# Altium schematic sheet Main.SchDoc
size 430 x 369 mm; SheetNumber: 1; SheetTotal: 14
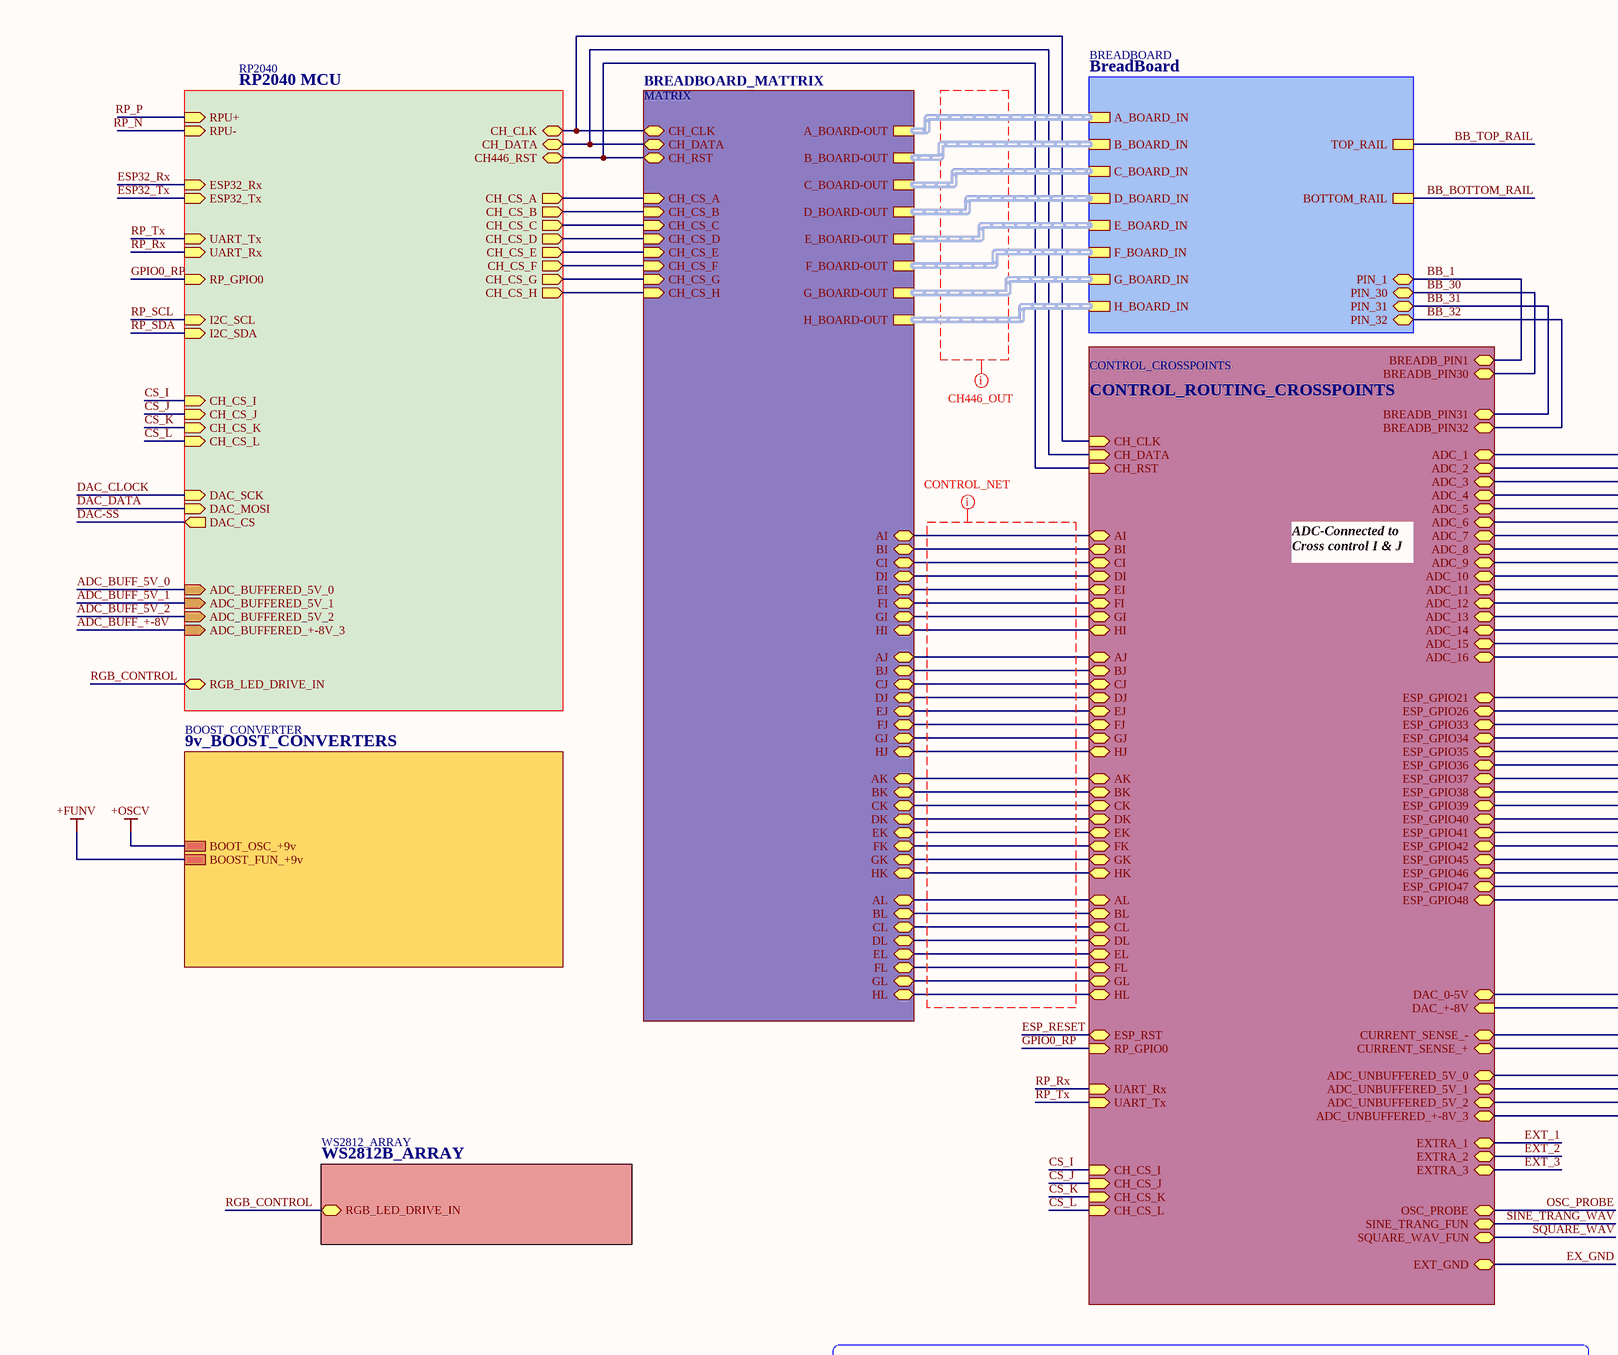
[diagram p0: Main.SchDoc, top left]
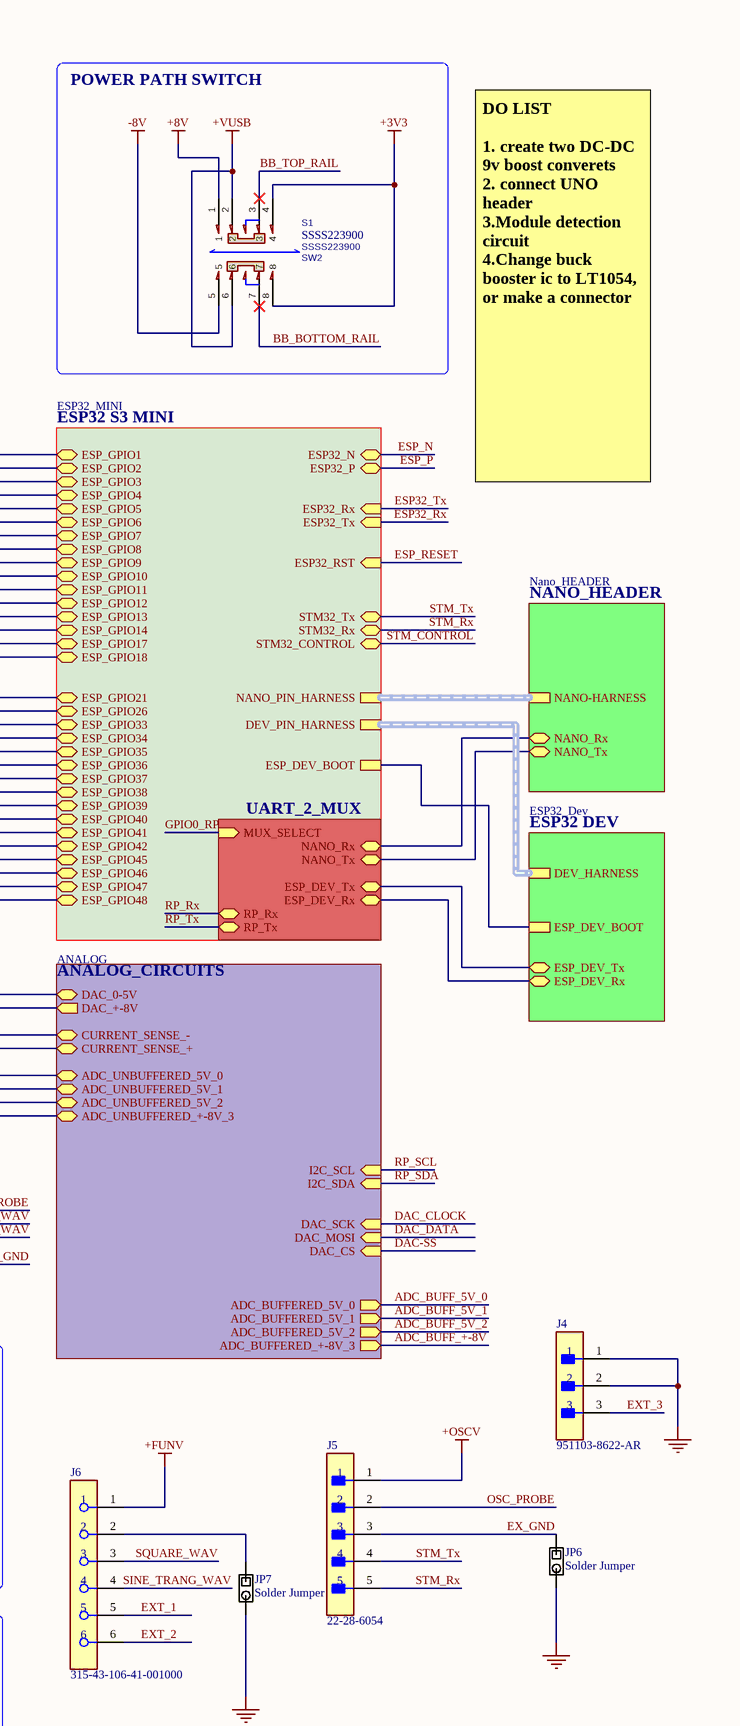
[diagram p1: Main.SchDoc, top right]
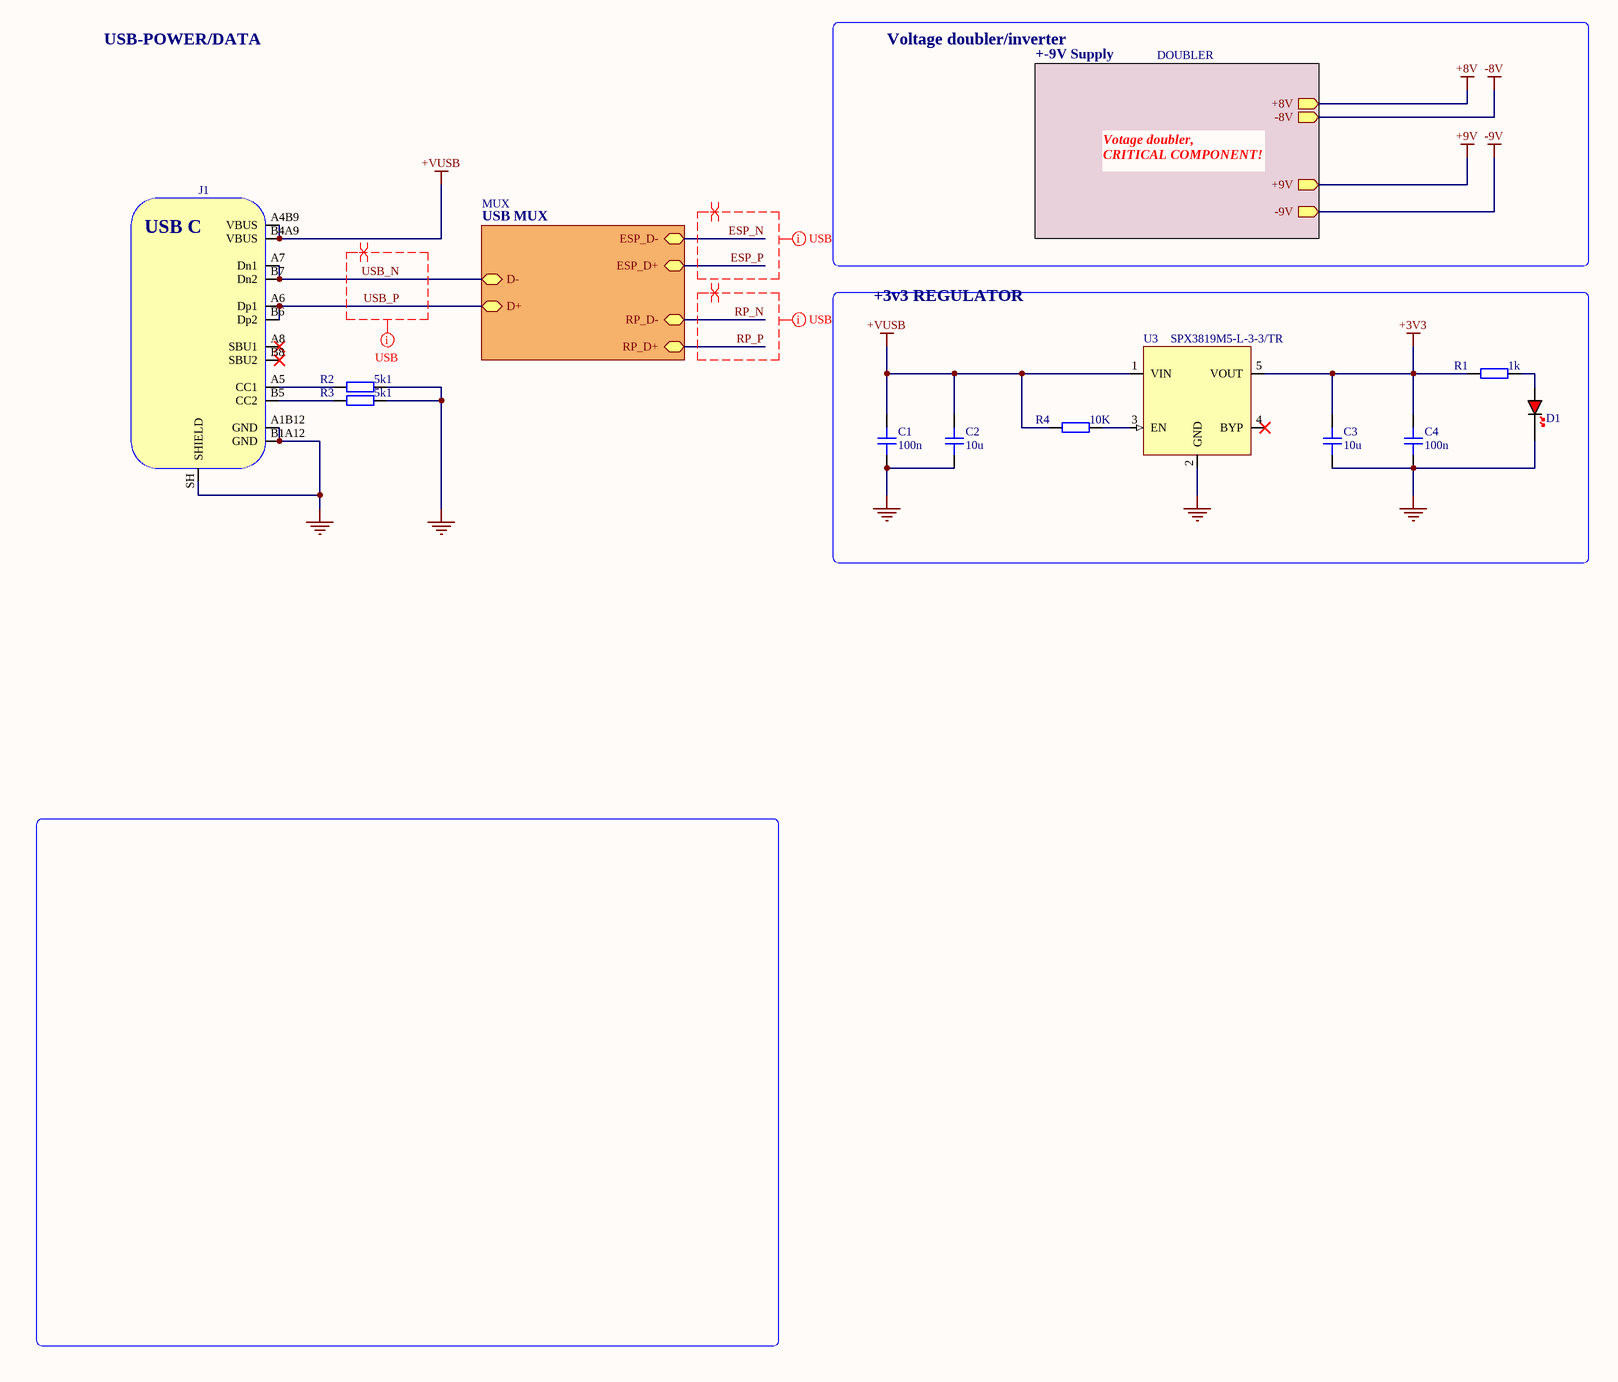
[diagram p2: Main.SchDoc, bottom left]
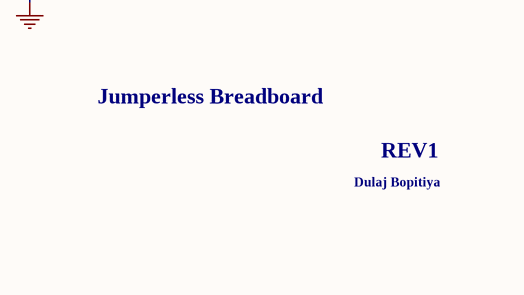
[diagram p3: Main.SchDoc, bottom right]

## Parts
C1  100n  [CAP_0805]
C2  10u  [CAP_0805]
C3  10u  [CAP_0805]
C4  100n  [CAP_0805]
D1  RED  [LED_0603_RED]  (value not drawn)
J1  B4105-GF-A-060  [USB4105-GF-A-060]  (value not drawn)
J4  951103-8622-AR  [FP-951103-8622-AR-MFG]
J5  22-28-6054  [FP-22-28-6054-MFG]
J6  315-43-106-41-001000  [FP-315-43-106-41-001000-MFG]
JP6  Solder Jumper  [SolderJumper_Single]
JP7  Solder Jumper  [SolderJumper_Single]
R1  1k  [RES_0603]
R2  5k1  [RES_0603]
R3  5k1  [RES_0603]
R4  10K  [RES_0603]
S1  SSSS223900  Reference: SW2  [SW-TH_SSSS223900]
U3  SPX3819M5-L-3-3/TR  [SOT-23-5]

## Blocks framed on the sheet
POWER PATH SWITCH: S1
+3v3 REGULATOR: C1-C4 D1 R1 R4 U3

## Sub-sheets
ANALOG = ANALOG_CIRCUITS: ADC_UNBUFFERED_5V_0 (bidir), ADC_BUFFERED_5V_0 (out), ADC_UNBUFFERED_5V_1 (bidir), ADC_BUFFERED_5V_1 (out), ADC_UNBUFFERED_5V_2 (bidir), ADC_BUFFERED_5V_2 (out), ADC_UNBUFFERED_+-8V_3 (bidir), ADC_BUFFERED_+-8V_3 (out), DAC_+-8V (out), DAC_MOSI (in), DAC_SCK (in), DAC_CS (in), I2C_SCL (in), I2C_SDA (in), CURRENT_SENSE_+ (bidir), CURRENT_SENSE_- (bidir), DAC_0-5V (bidir)
BOOST_CONVERTER = 9v_BOOST_CONVERTERS: BOOT_OSC_+9v, BOOST_FUN_+9v
BREADBOARD = BreadBoard: A_BOARD_IN (harness A_BOARD_H), B_BOARD_IN (harness B_BOARD_H), C_BOARD_IN (harness C_BOARD_H), D_BOARD_IN (harness D_BOARD_H), E_BOARD_IN (harness E_BOARD_H), F_BOARD_IN (harness F_BOARD_H), G_BOARD_IN (harness G_BOARD_H), H_BOARD_IN (harness H_BOARD_H), PIN_1 (bidir), PIN_31 (bidir), PIN_32 (bidir), PIN_30 (bidir), TOP_RAIL, BOTTOM_RAIL
CONTROL_CROSSPOINTS = CONTROL_ROUTING_CROSSPOINTS: CH_CLK (in), CH_DATA (in), CH_RST (in), AI (bidir), BI (bidir), CI (bidir), DI (bidir), EI (bidir), FI (bidir), GI (bidir), HI (bidir), AJ (bidir), BJ (bidir), CJ (bidir), DJ (bidir), EJ (bidir), FJ (bidir), GJ (bidir), HJ (bidir), AK (bidir), BK (bidir), CK (bidir), DK (bidir), EK (bidir), FK (bidir), GK (bidir), HK (bidir), AL (bidir), BL (bidir), CL (bidir), DL (bidir), EL (bidir), FL (bidir), GL (bidir), HL (bidir), CH_CS_I (in), CH_CS_J (in), CH_CS_K (in), CH_CS_L (in), ADC_1 (bidir), ADC_2 (bidir), ADC_3 (bidir), ADC_4 (bidir), ADC_5 (bidir), ADC_6 (bidir), ADC_7 (bidir), ADC_8 (bidir), ADC_9 (bidir), ADC_10 (bidir), ADC_11 (bidir), ADC_12 (bidir), ADC_13 (bidir), ADC_14 (bidir), ESP_GPIO21 (bidir), ESP_GPIO26 (bidir), ESP_GPIO33 (bidir), ESP_GPIO34 (bidir), ESP_GPIO35 (bidir), ESP_GPIO36 (bidir), ESP_GPIO37 (bidir), ESP_GPIO38 (bidir), ESP_GPIO39 (bidir), ESP_GPIO40 (bidir), ESP_GPIO48 (bidir), ESP_GPIO47 (bidir), ESP_GPIO41 (bidir), ESP_GPIO42 (bidir), ESP_GPIO45 (bidir), ESP_GPIO46 (bidir), ADC_15 (bidir), ADC_16 (bidir), DAC_0-5V (bidir), CURRENT_SENSE_- (bidir), CURRENT_SENSE_+ (bidir), ADC_UNBUFFERED_+-8V_3 (bidir), DAC_+-8V (in), ESP_RST (bidir), ADC_UNBUFFERED_5V_0 (bidir), ADC_UNBUFFERED_5V_1 (bidir), ADC_UNBUFFERED_5V_2 (bidir), BREADB_PIN1 (bidir), BREADB_PIN30 (bidir), BREADB_PIN32 (bidir), BREADB_PIN31 (bidir), RP_GPIO0 (in), UART_Rx (in), UART_Tx (in), OSC_PROBE (bidir), EXT_GND (bidir), SQUARE_WAV_FUN (bidir), SINE_TRANG_FUN (bidir), EXTRA_1 (bidir), EXTRA_2 (bidir), EXTRA_3 (bidir)
Designator = UART_2_MUX: MUX_SELECT (in), RP_Tx (bidir), RP_Rx (bidir), ESP_DEV_Rx (bidir), ESP_DEV_Tx (bidir), NANO_Rx (bidir), NANO_Tx (bidir)
DOUBLER = +-9V Supply: +9V (out), -9V (out), +8V (out), -8V (out)
ESP32_Dev = ESP32 DEV: ESP_DEV_BOOT, ESP_DEV_Tx (bidir), ESP_DEV_Rx (bidir), DEV_HARNESS (harness DEV_HARNESS)
ESP32_MINI = ESP32 S3 MINI: ESP32_N (bidir), ESP32_P (bidir), ESP32_Rx (in), ESP32_Tx (in), ESP_GPIO1 (bidir), ESP_GPIO2 (bidir), ESP_GPIO3 (bidir), ESP_GPIO4 (bidir), ESP_GPIO5 (bidir), ESP_GPIO6 (bidir), ESP_GPIO7 (bidir), ESP_GPIO8 (bidir), ESP_GPIO9 (bidir), ESP_GPIO10 (bidir), ESP_GPIO11 (bidir), ESP_GPIO12 (bidir), ESP_GPIO13 (bidir), ESP_GPIO14 (bidir), ESP_GPIO17 (bidir), ESP_GPIO18 (bidir), ESP_GPIO21 (bidir), ESP_GPIO26 (bidir), ESP_GPIO48 (bidir), ESP_GPIO47 (bidir), ESP_GPIO33 (bidir), ESP_GPIO34 (bidir), ESP_GPIO35 (bidir), ESP_GPIO36 (bidir), ESP_GPIO37 (bidir), ESP_GPIO38 (bidir), ESP_GPIO39 (bidir), ESP_GPIO40 (bidir), ESP_GPIO41 (bidir), ESP_GPIO42 (bidir), ESP_GPIO45 (bidir), ESP_GPIO46 (bidir), ESP32_RST (in), NANO_PIN_HARNESS (harness NANO-HARNESS), DEV_PIN_HARNESS (harness DEV_HARNESS), ESP_DEV_BOOT, STM32_Tx (bidir), STM32_Rx (bidir), STM32_CONTROL (bidir)
MATRIX = BREADBOARD_MATTRIX: B_BOARD-OUT (harness B_BOARD_H), C_BOARD-OUT (harness C_BOARD_H), D_BOARD-OUT (harness D_BOARD_H), E_BOARD-OUT (harness E_BOARD_H), F_BOARD-OUT (harness F_BOARD_H), G_BOARD-OUT (harness G_BOARD_H), H_BOARD-OUT (harness H_BOARD_H), A_BOARD-OUT (harness A_BOARD_H), AL (bidir), BL (bidir), CL (bidir), DL (bidir), EL (bidir), FL (bidir), GL (bidir), HL (bidir), CH_CLK (bidir), CH_DATA (bidir), CH_RST (bidir), CH_CS_A (in), CH_CS_B (in), CH_CS_C (in), CH_CS_D (in), CH_CS_E (in), CH_CS_F (in), CH_CS_G (in), CH_CS_H (in), AI (bidir), BI (bidir), CI (bidir), DI (bidir), EI (bidir), FI (bidir), GI (bidir), HI (bidir), AJ (bidir), BJ (bidir), CJ (bidir), DJ (bidir), EJ (bidir), FJ (bidir), GJ (bidir), HJ (bidir), AK (bidir), BK (bidir), CK (bidir), DK (bidir), EK (bidir), FK (bidir), GK (bidir), HK (bidir)
MUX = USB MUX: D+ (bidir), D- (bidir), ESP_D- (bidir), ESP_D+ (bidir), RP_D- (bidir), RP_D+ (bidir)
Nano_HEADER = NANO_HEADER: NANO-HARNESS (harness NANO-HARNESS), NANO_Rx (bidir), NANO_Tx (bidir)
RP2040 = RP2040 MCU: RPU+ (in), RPU- (in), DAC_MOSI (in), DAC_SCK (in), DAC_CS (out), I2C_SDA (in), I2C_SCL (in), ADC_BUFFERED_5V_0 (in), ADC_BUFFERED_5V_1 (in), ADC_BUFFERED_5V_2 (in), ADC_BUFFERED_+-8V_3 (in), ESP32_Rx (in), ESP32_Tx (in), UART_Rx (in), UART_Tx (in), CH_CS_A (out), CH_CS_B (out), CH_CS_C (out), CH_CS_D (out), CH_CS_E (out), CH_CS_F (out), CH_CS_G (out), CH_CS_H (out), CH_CLK (bidir), CH_DATA (bidir), RGB_LED_DRIVE_IN (bidir), CH446_RST (bidir), CH_CS_I (in), CH_CS_J (in), CH_CS_K (in), CH_CS_L (in), RP_GPIO0 (in)
WS2812_ARRAY = WS2812B_ARRAY: RGB_LED_DRIVE_IN (bidir)

## Nets
+3V3: C3.2 C4.2 R1.1 S1.4 S1.8 U3.5(VOUT)
+8V: S1.1 ; sheet DOUBLER/+8V
+9V: sheet DOUBLER/+9V
+FUNV: J6.1 ; sheet BOOST_CONVERTER/BOOST_FUN_+9v
+OSCV: J5.1 ; sheet BOOST_CONVERTER/BOOT_OSC_+9v
+VUSB: C1.2 C2.2 J1.A4B9(VBUS) J1.B4A9(VBUS) R4.1 S1.2 S1.6 U3.1(VIN)
-8V: S1.5 ; sheet DOUBLER/-8V
-9V: sheet DOUBLER/-9V
GND: C1.1 C2.1 C3.1 C4.1 D1.K J1.A1B12(GND) J1.B1A12(GND) J1.SH(SHIELD) J4.1 J4.2 JP6.2 JP7.2 R2.2 R3.2 U3.2(GND)
ADC_BUFF_5V_0: sheet RP2040/ADC_BUFFERED_5V_0, sheet ANALOG/ADC_BUFFERED_5V_0
ADC_BUFF_5V_1: sheet RP2040/ADC_BUFFERED_5V_1, sheet ANALOG/ADC_BUFFERED_5V_1
ADC_BUFF_5V_2: sheet RP2040/ADC_BUFFERED_5V_2, sheet ANALOG/ADC_BUFFERED_5V_2
ADC_BUFF_+-8V: sheet RP2040/ADC_BUFFERED_+-8V_3, sheet ANALOG/ADC_BUFFERED_+-8V_3
BB_1: sheet BREADBOARD/PIN_1, sheet CONTROL_CROSSPOINTS/BREADB_PIN1
BB_30: sheet BREADBOARD/PIN_30, sheet CONTROL_CROSSPOINTS/BREADB_PIN30
BB_31: sheet BREADBOARD/PIN_31, sheet CONTROL_CROSSPOINTS/BREADB_PIN31
BB_32: sheet BREADBOARD/PIN_32, sheet CONTROL_CROSSPOINTS/BREADB_PIN32
BB_BOTTOM_RAIL: S1.7 ; sheet BREADBOARD/BOTTOM_RAIL
BB_TOP_RAIL: S1.3 ; sheet BREADBOARD/TOP_RAIL
CS_I: sheet RP2040/CH_CS_I, sheet CONTROL_CROSSPOINTS/CH_CS_I
CS_J: sheet RP2040/CH_CS_J, sheet CONTROL_CROSSPOINTS/CH_CS_J
CS_K: sheet RP2040/CH_CS_K, sheet CONTROL_CROSSPOINTS/CH_CS_K
CS_L: sheet RP2040/CH_CS_L, sheet CONTROL_CROSSPOINTS/CH_CS_L
DAC-SS: sheet RP2040/DAC_CS, sheet ANALOG/DAC_CS
DAC_CLOCK: sheet RP2040/DAC_SCK, sheet ANALOG/DAC_SCK
DAC_DATA: sheet RP2040/DAC_MOSI, sheet ANALOG/DAC_MOSI
ESP32_Rx: sheet RP2040/ESP32_Rx, sheet ESP32_MINI/ESP32_Tx
ESP32_Tx: sheet RP2040/ESP32_Tx, sheet ESP32_MINI/ESP32_Rx
ESP_N: sheet MUX/ESP_D-, sheet ESP32_MINI/ESP32_N
ESP_P: sheet MUX/ESP_D+, sheet ESP32_MINI/ESP32_P
ESP_RESET: sheet ESP32_MINI/ESP32_RST, sheet CONTROL_CROSSPOINTS/ESP_RST
EX_GND: J5.3 JP6.1 ; sheet CONTROL_CROSSPOINTS/EXT_GND
EXT_1: J6.5 ; sheet CONTROL_CROSSPOINTS/EXTRA_1
EXT_2: J6.6 ; sheet CONTROL_CROSSPOINTS/EXTRA_2
EXT_3: J4.3 ; sheet CONTROL_CROSSPOINTS/EXTRA_3
GPIO0_RP: sheet RP2040/RP_GPIO0, sheet CONTROL_CROSSPOINTS/RP_GPIO0, sheet Designator/MUX_SELECT
OSC_PROBE: J5.2 ; sheet CONTROL_CROSSPOINTS/OSC_PROBE
RGB_CONTROL: sheet RP2040/RGB_LED_DRIVE_IN, sheet WS2812_ARRAY/RGB_LED_DRIVE_IN
RP_N: sheet MUX/RP_D-, sheet RP2040/RPU-
RP_P: sheet MUX/RP_D+, sheet RP2040/RPU+
RP_Rx: sheet RP2040/UART_Rx, sheet CONTROL_CROSSPOINTS/UART_Rx, sheet Designator/RP_Rx
RP_SCL: sheet RP2040/I2C_SCL, sheet ANALOG/I2C_SCL
RP_SDA: sheet RP2040/I2C_SDA, sheet ANALOG/I2C_SDA
RP_Tx: sheet RP2040/UART_Tx, sheet CONTROL_CROSSPOINTS/UART_Tx, sheet Designator/RP_Tx
SINE_TRANG_WAV: J6.4 ; sheet CONTROL_CROSSPOINTS/SINE_TRANG_FUN
SQUARE_WAV: J6.3 ; sheet CONTROL_CROSSPOINTS/SQUARE_WAV_FUN
STM_CONTROL: sheet ESP32_MINI/STM32_CONTROL
STM_Rx: J5.5 ; sheet ESP32_MINI/STM32_Rx
STM_Tx: J5.4 ; sheet ESP32_MINI/STM32_Tx
USB_N: J1.A7(Dn1) J1.B7(Dn2) ; sheet MUX/D-
USB_P: J1.A6(Dp1) J1.B6(Dp2) ; sheet MUX/D+
NetD1_A: D1.A R1.2
NetJ1_A5: J1.A5(CC1) R2.1
NetJ1_B5: J1.B5(CC2) R3.1
NetJ6_2: J6.2 JP7.1
NetR4_2: R4.2 U3.3(EN)
(unnamed): sheet MATRIX/AL, sheet CONTROL_CROSSPOINTS/AL
(unnamed): sheet MATRIX/BL, sheet CONTROL_CROSSPOINTS/BL
(unnamed): sheet MATRIX/CL, sheet CONTROL_CROSSPOINTS/CL
(unnamed): sheet MATRIX/DL, sheet CONTROL_CROSSPOINTS/DL
(unnamed): sheet MATRIX/EL, sheet CONTROL_CROSSPOINTS/EL
(unnamed): sheet MATRIX/FL, sheet CONTROL_CROSSPOINTS/FL
(unnamed): sheet MATRIX/GL, sheet CONTROL_CROSSPOINTS/GL
(unnamed): sheet MATRIX/HL, sheet CONTROL_CROSSPOINTS/HL
(unnamed): sheet MATRIX/CH_CLK, sheet RP2040/CH_CLK, sheet CONTROL_CROSSPOINTS/CH_CLK
(unnamed): sheet MATRIX/CH_DATA, sheet RP2040/CH_DATA, sheet CONTROL_CROSSPOINTS/CH_DATA
(unnamed): sheet MATRIX/CH_RST, sheet RP2040/CH446_RST, sheet CONTROL_CROSSPOINTS/CH_RST
(unnamed): sheet MATRIX/CH_CS_A, sheet RP2040/CH_CS_A
(unnamed): sheet MATRIX/CH_CS_B, sheet RP2040/CH_CS_B
(unnamed): sheet MATRIX/CH_CS_C, sheet RP2040/CH_CS_C
(unnamed): sheet MATRIX/CH_CS_D, sheet RP2040/CH_CS_D
(unnamed): sheet MATRIX/CH_CS_E, sheet RP2040/CH_CS_E
(unnamed): sheet MATRIX/CH_CS_F, sheet RP2040/CH_CS_F
(unnamed): sheet MATRIX/CH_CS_G, sheet RP2040/CH_CS_G
(unnamed): sheet MATRIX/CH_CS_H, sheet RP2040/CH_CS_H
(unnamed): sheet MATRIX/AI, sheet CONTROL_CROSSPOINTS/AI
(unnamed): sheet MATRIX/BI, sheet CONTROL_CROSSPOINTS/BI
(unnamed): sheet MATRIX/CI, sheet CONTROL_CROSSPOINTS/CI
(unnamed): sheet MATRIX/DI, sheet CONTROL_CROSSPOINTS/DI
(unnamed): sheet MATRIX/EI, sheet CONTROL_CROSSPOINTS/EI
(unnamed): sheet MATRIX/FI, sheet CONTROL_CROSSPOINTS/FI
(unnamed): sheet MATRIX/GI, sheet CONTROL_CROSSPOINTS/GI
(unnamed): sheet MATRIX/HI, sheet CONTROL_CROSSPOINTS/HI
(unnamed): sheet MATRIX/AJ, sheet CONTROL_CROSSPOINTS/AJ
(unnamed): sheet MATRIX/BJ, sheet CONTROL_CROSSPOINTS/BJ
(unnamed): sheet MATRIX/CJ, sheet CONTROL_CROSSPOINTS/CJ
(unnamed): sheet MATRIX/DJ, sheet CONTROL_CROSSPOINTS/DJ
(unnamed): sheet MATRIX/EJ, sheet CONTROL_CROSSPOINTS/EJ
(unnamed): sheet MATRIX/FJ, sheet CONTROL_CROSSPOINTS/FJ
(unnamed): sheet MATRIX/GJ, sheet CONTROL_CROSSPOINTS/GJ
(unnamed): sheet MATRIX/HJ, sheet CONTROL_CROSSPOINTS/HJ
(unnamed): sheet MATRIX/AK, sheet CONTROL_CROSSPOINTS/AK
(unnamed): sheet MATRIX/BK, sheet CONTROL_CROSSPOINTS/BK
(unnamed): sheet MATRIX/CK, sheet CONTROL_CROSSPOINTS/CK
(unnamed): sheet MATRIX/DK, sheet CONTROL_CROSSPOINTS/DK
(unnamed): sheet MATRIX/EK, sheet CONTROL_CROSSPOINTS/EK
(unnamed): sheet MATRIX/FK, sheet CONTROL_CROSSPOINTS/FK
(unnamed): sheet MATRIX/GK, sheet CONTROL_CROSSPOINTS/GK
(unnamed): sheet MATRIX/HK, sheet CONTROL_CROSSPOINTS/HK
(unnamed): sheet ESP32_MINI/ESP_GPIO1, sheet CONTROL_CROSSPOINTS/ADC_1
(unnamed): sheet ESP32_MINI/ESP_GPIO2, sheet CONTROL_CROSSPOINTS/ADC_2
(unnamed): sheet ESP32_MINI/ESP_GPIO3, sheet CONTROL_CROSSPOINTS/ADC_3
(unnamed): sheet ESP32_MINI/ESP_GPIO4, sheet CONTROL_CROSSPOINTS/ADC_4
(unnamed): sheet ESP32_MINI/ESP_GPIO5, sheet CONTROL_CROSSPOINTS/ADC_5
(unnamed): sheet ESP32_MINI/ESP_GPIO6, sheet CONTROL_CROSSPOINTS/ADC_6
(unnamed): sheet ESP32_MINI/ESP_GPIO7, sheet CONTROL_CROSSPOINTS/ADC_7
(unnamed): sheet ESP32_MINI/ESP_GPIO8, sheet CONTROL_CROSSPOINTS/ADC_8
(unnamed): sheet ESP32_MINI/ESP_GPIO9, sheet CONTROL_CROSSPOINTS/ADC_9
(unnamed): sheet ESP32_MINI/ESP_GPIO10, sheet CONTROL_CROSSPOINTS/ADC_10
(unnamed): sheet ESP32_MINI/ESP_GPIO11, sheet CONTROL_CROSSPOINTS/ADC_11
(unnamed): sheet ESP32_MINI/ESP_GPIO12, sheet CONTROL_CROSSPOINTS/ADC_12
(unnamed): sheet ESP32_MINI/ESP_GPIO13, sheet CONTROL_CROSSPOINTS/ADC_13
(unnamed): sheet ESP32_MINI/ESP_GPIO14, sheet CONTROL_CROSSPOINTS/ADC_14
(unnamed): sheet ESP32_MINI/ESP_GPIO17, sheet CONTROL_CROSSPOINTS/ADC_15
(unnamed): sheet ESP32_MINI/ESP_GPIO18, sheet CONTROL_CROSSPOINTS/ADC_16
(unnamed): sheet ESP32_MINI/ESP_GPIO21, sheet CONTROL_CROSSPOINTS/ESP_GPIO21
(unnamed): sheet ESP32_MINI/ESP_GPIO26, sheet CONTROL_CROSSPOINTS/ESP_GPIO26
(unnamed): sheet ESP32_MINI/ESP_GPIO48, sheet CONTROL_CROSSPOINTS/ESP_GPIO48
(unnamed): sheet ESP32_MINI/ESP_GPIO47, sheet CONTROL_CROSSPOINTS/ESP_GPIO47
(unnamed): sheet ESP32_MINI/ESP_GPIO33, sheet CONTROL_CROSSPOINTS/ESP_GPIO33
(unnamed): sheet ESP32_MINI/ESP_GPIO34, sheet CONTROL_CROSSPOINTS/ESP_GPIO34
(unnamed): sheet ESP32_MINI/ESP_GPIO35, sheet CONTROL_CROSSPOINTS/ESP_GPIO35
(unnamed): sheet ESP32_MINI/ESP_GPIO36, sheet CONTROL_CROSSPOINTS/ESP_GPIO36
(unnamed): sheet ESP32_MINI/ESP_GPIO37, sheet CONTROL_CROSSPOINTS/ESP_GPIO37
(unnamed): sheet ESP32_MINI/ESP_GPIO38, sheet CONTROL_CROSSPOINTS/ESP_GPIO38
(unnamed): sheet ESP32_MINI/ESP_GPIO39, sheet CONTROL_CROSSPOINTS/ESP_GPIO39
(unnamed): sheet ESP32_MINI/ESP_GPIO40, sheet CONTROL_CROSSPOINTS/ESP_GPIO40
(unnamed): sheet ESP32_MINI/ESP_GPIO41, sheet CONTROL_CROSSPOINTS/ESP_GPIO41
(unnamed): sheet ESP32_MINI/ESP_GPIO42, sheet CONTROL_CROSSPOINTS/ESP_GPIO42
(unnamed): sheet ESP32_MINI/ESP_GPIO45, sheet CONTROL_CROSSPOINTS/ESP_GPIO45
(unnamed): sheet ESP32_MINI/ESP_GPIO46, sheet CONTROL_CROSSPOINTS/ESP_GPIO46
(unnamed): sheet ESP32_MINI/ESP_DEV_BOOT, sheet ESP32_Dev/ESP_DEV_BOOT
(unnamed): sheet ANALOG/ADC_UNBUFFERED_5V_0, sheet CONTROL_CROSSPOINTS/ADC_UNBUFFERED_5V_0
(unnamed): sheet ANALOG/ADC_UNBUFFERED_5V_1, sheet CONTROL_CROSSPOINTS/ADC_UNBUFFERED_5V_1
(unnamed): sheet ANALOG/ADC_UNBUFFERED_5V_2, sheet CONTROL_CROSSPOINTS/ADC_UNBUFFERED_5V_2
(unnamed): sheet ANALOG/ADC_UNBUFFERED_+-8V_3, sheet CONTROL_CROSSPOINTS/ADC_UNBUFFERED_+-8V_3
(unnamed): sheet ANALOG/DAC_+-8V, sheet CONTROL_CROSSPOINTS/DAC_+-8V
(unnamed): sheet ANALOG/CURRENT_SENSE_+, sheet CONTROL_CROSSPOINTS/CURRENT_SENSE_+
(unnamed): sheet ANALOG/CURRENT_SENSE_-, sheet CONTROL_CROSSPOINTS/CURRENT_SENSE_-
(unnamed): sheet ANALOG/DAC_0-5V, sheet CONTROL_CROSSPOINTS/DAC_0-5V
(unnamed): sheet Nano_HEADER/NANO_Rx, sheet Designator/NANO_Rx
(unnamed): sheet Nano_HEADER/NANO_Tx, sheet Designator/NANO_Tx
(unnamed): sheet ESP32_Dev/ESP_DEV_Tx, sheet Designator/ESP_DEV_Tx
(unnamed): sheet ESP32_Dev/ESP_DEV_Rx, sheet Designator/ESP_DEV_Rx

Not connected (* = marked no-connect by the designer): J1 A8(SBU1)* B8(SBU2)*; U3 4(BYP)*

## Buses and harness runs
harness sheet BREADBOARD/A_BOARD_IN = sheet MATRIX/A_BOARD-OUT
harness sheet BREADBOARD/B_BOARD_IN = sheet MATRIX/B_BOARD-OUT
harness sheet BREADBOARD/C_BOARD_IN = sheet MATRIX/C_BOARD-OUT
harness sheet BREADBOARD/D_BOARD_IN = sheet MATRIX/D_BOARD-OUT
harness sheet BREADBOARD/E_BOARD_IN = sheet MATRIX/E_BOARD-OUT
harness sheet BREADBOARD/F_BOARD_IN = sheet MATRIX/F_BOARD-OUT
harness sheet BREADBOARD/G_BOARD_IN = sheet MATRIX/G_BOARD-OUT
harness sheet BREADBOARD/H_BOARD_IN = sheet MATRIX/H_BOARD-OUT
harness sheet ESP32_Dev/DEV_HARNESS = sheet ESP32_MINI/DEV_PIN_HARNESS
harness sheet ESP32_MINI/NANO_PIN_HARNESS = sheet Nano_HEADER/NANO-HARNESS

## Layout directives
mark named CH446_OUT: (no net found under the mark)
differential pair: ESP_N, ESP_P, RP_N, RP_P, USB_N, USB_P
mark named USB: ESP_N, ESP_P, RP_N, RP_P, USB_N, USB_P
mark named CONTROL_NET: (no net found under the mark)

## Notes on the sheet
- DO LIST
  1. create two DC-DC 9v boost converets
  2. connect UNO header
  3.Module detection circuit
  4.Change buck booster ic to LT1054, or make a connector
- ADC-Connected to Cross control I & J
- USB-POWER/DATA
- Voltage doubler/inverter
- Votage doubler,
  CRITICAL COMPONENT!
- Jumperless Breadboard
- REV1
- Dulaj Bopitiya
- (in symbol USB4105-GF-A-060) USB C

## Library data of the parts
C1-C4 = CAP_0805: Capacitor SMD 0805; Manufacturer: *; Manufacturer Part Number: *; Distributor Link: *; LCSC: *; Rating: *; Dielectric: *
D1 = LED_0603_RED: LED 0603 RED SMD
J1 = USB4105-GF-A-060: USB Connector Type C SMT 12 Pin; Manufacturer: GCT; Manufacturer Part Number: USB4105-GF-A-060; Distributor Link: https://eu.mouser.com/ProductDetail/GCT/USB4105-GF-A-060?qs=QNEnbhJQKvY2mocwNJzgfA%3D%3D
J4 = CMP-05379-000003-1: CONN HEADER VERT 3POS 2MM; Manufacturer: 3M; Conn Gender: Male; Current Rating: 2A; Number Of Contacts: 3; Conn Orientation: Straight; Digikey Description: CONN HEADER VERT 3POS 2MM; Device Class L3: unset; Category: Conn; Height: 6.3mm; Manufacturer Part Number: 951103-8622-AR; RoHS: TRUE; Contact Material: Gold,Nickel; ComponentLink2Description: Datasheet; Temperature Range Low: -55°C; Device Class L1: Connectors; Pitch: 2mm; Mouser Description: Header; PinStrip; CopperAlloy; HighTempThermoplastic; 3Cnts; 1A; RtAngle; 951Series; Octopart: https://octopart.com/951103-8622-ar-3m-14400669; Package: 951103-8622-AR; Lead Free: Yes; Device Class L2: Headers and Wire Housings; Temperature Range High: +125°C; ComponentLink2URL: http://multimedia.3m.com/mws/media/1400506O/3m-pin-strip-header-951-series-78-5100-2653-3.pdf; Automotive: No; Temperature: -55°C to +125°C; Number Of Rows: 1
J5 = CMP-04776-001058-1: KK 100 HDR ASSY RA BKWY 05 CKT 3; Number of Positions: 5; Current Rating: 4A; Contact Resistance: 20mR; Gender: Male; Pitch: 2.54mm; Voltage Rating: 250V; Glow Wire Compliant: Non-compliant; Min Operating Temperature: 0°C; Number of Circuits: 5; Number of Rows: 1; Termination: Solder; Orientation: Right Angle; ELV: Compliant; Package Quantity: 1500; Contact Plating: Gold; RoHS Compliant: Yes; Max Operating Temperature: 75°C; Number of Contacts: 5; Mount: Through Hole; Packaging: Bulk; Series: 42376; Flammability Rating: UL94 V-0
J6 = CMP-00254-12081839-1: 315-43-106-41-001000 IC & Component Sockets Interconnect Socket; Number of Positions: 6; Pitch: 2.54mm; Connector Type: Receptacle, Socket; Contact Plating: Gold; NexarPartId: 12081839; Mount: Through Hole; RoHS: Compliant; Termination: Solder; Packaging: Bulk; Color: Black; Number of Rows: 1
JP6 JP7 = SolderJumper_Single: Solder Jumper Single 0.5mm Pitch
R1-R4 = RES_0603: Resistor SMD 0603; Manufacturer: *; Manufacturer Part Number: *; Distributor Link: *; LCSC: *
U3 = SPX3819M5-L-3-3/TR: 500mA +3.3V Low-Noise LDO Voltage Regulator; Manufacturer: MaxLinear; Manufacturer Part Number: SPX3819M5-L-3-3/TR
S1 = SSSS223900: Footprint: easyeda2kicad:SW-TH_SSSS223900; Datasheet: https://lcsc.com/product-detail/Toggle-Switches_ALPS_SSSS223900_SSSS223900_C160874.html; LCSC Part: C160874; Value: SSSS223900